# EAGLE design SpectrumCtrl (EAGLE 7.2.0)
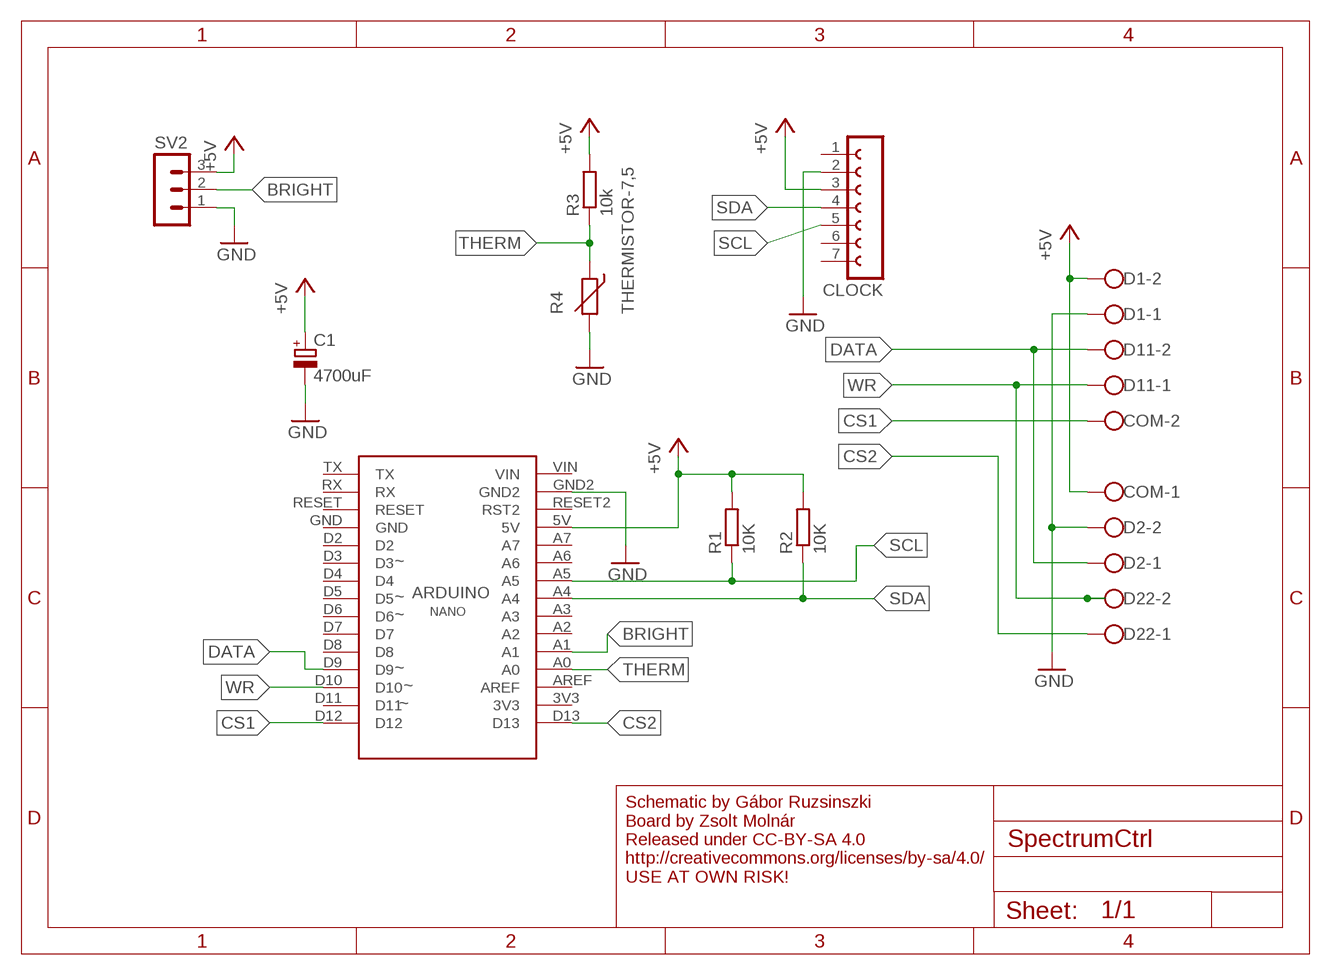
[diagram p0: schematic, sheet 1]

## Parts
C1  4700uF  CPOL-EUE7.5-16  [E7,5-16]
CLOCK  FE07-1  [FE07]
COM  W237-102  [W237-102]
D1  W237-102  [W237-102]
D2  W237-102  [W237-102]
D11  W237-102  [W237-102]
D22  W237-102  [W237-102]
R1  10K  R-EU_0309/12  [0309/12]
R2  10K  R-EU_0309/12  [0309/12]
R3  10k  R-EU_0309/12  [0309/12]
R4  THERMISTOR-7,5  [R-7,5]
SV2  MA03-1  [MA03-1]
U$1  NANO  [NANO]

## Nets
+5V: C1.+ CLOCK.3 COM.1 D1.2 R1.2 R2.2 R3.2 SV2.3 U$1.5V
BRIGHT: SV2.2 U$1.A1
CS1: COM.2 U$1.D12
CS2: D22.1 U$1.D13
DATA: D2.1 D11.2 U$1.D9
GND: C1.- CLOCK.2 D1.1 D2.2 R4.2 SV2.1 U$1.GND2
SCL: CLOCK.5 R1.1 U$1.A5
SDA: CLOCK.4 R2.1 U$1.A4
THERM: R3.1 R4.1 U$1.A0
WR: D11.1 D22.2 U$1.D10
Unconnected: CLOCK.1 CLOCK.6 CLOCK.7 U$1.3V3 U$1.A2 U$1.A3 U$1.A6 U$1.A7 U$1.AREF U$1.D2 U$1.D3 U$1.D4 U$1.D5 U$1.D6 U$1.D7 U$1.D8 U$1.D11 U$1.GND U$1.RESET U$1.RESET2(RST2) U$1.RX U$1.TX U$1.VIN

## Notes on the sheet
- Schematic by Gábor Ruzsinszki
  Board by Zsolt Molnár
  Released under CC-BY-SA 4.0
  http://creativecommons.org/licenses/by-sa/4.0/
  USE AT OWN RISK!

## Library data of the parts
C1 = rcl:CPOL-EU: POLARIZED CAPACITOR, European symbol
CLOCK = con-lsta:FE07-1: FEMALE HEADER; OC_FARNELL: unknown; OC_NEWARK: unknown
COM D1 D2 D11 D22 = con-wago-500:W237-102: WAGO SCREW CLAMP; MPN: 237-102; OC_FARNELL: unknown; OC_NEWARK: 70K9898
R1-R3 = rcl:R-EU_: RESISTOR, European symbol
R4 = varistor:THERMISTOR: THERMISTOR
SV2 = con-lstb:MA03-1: PIN HEADER; OC_FARNELL: unknown; OC_NEWARK: unknown
U$1 = Webmaster442:NANO: Arduino Nano

## Board
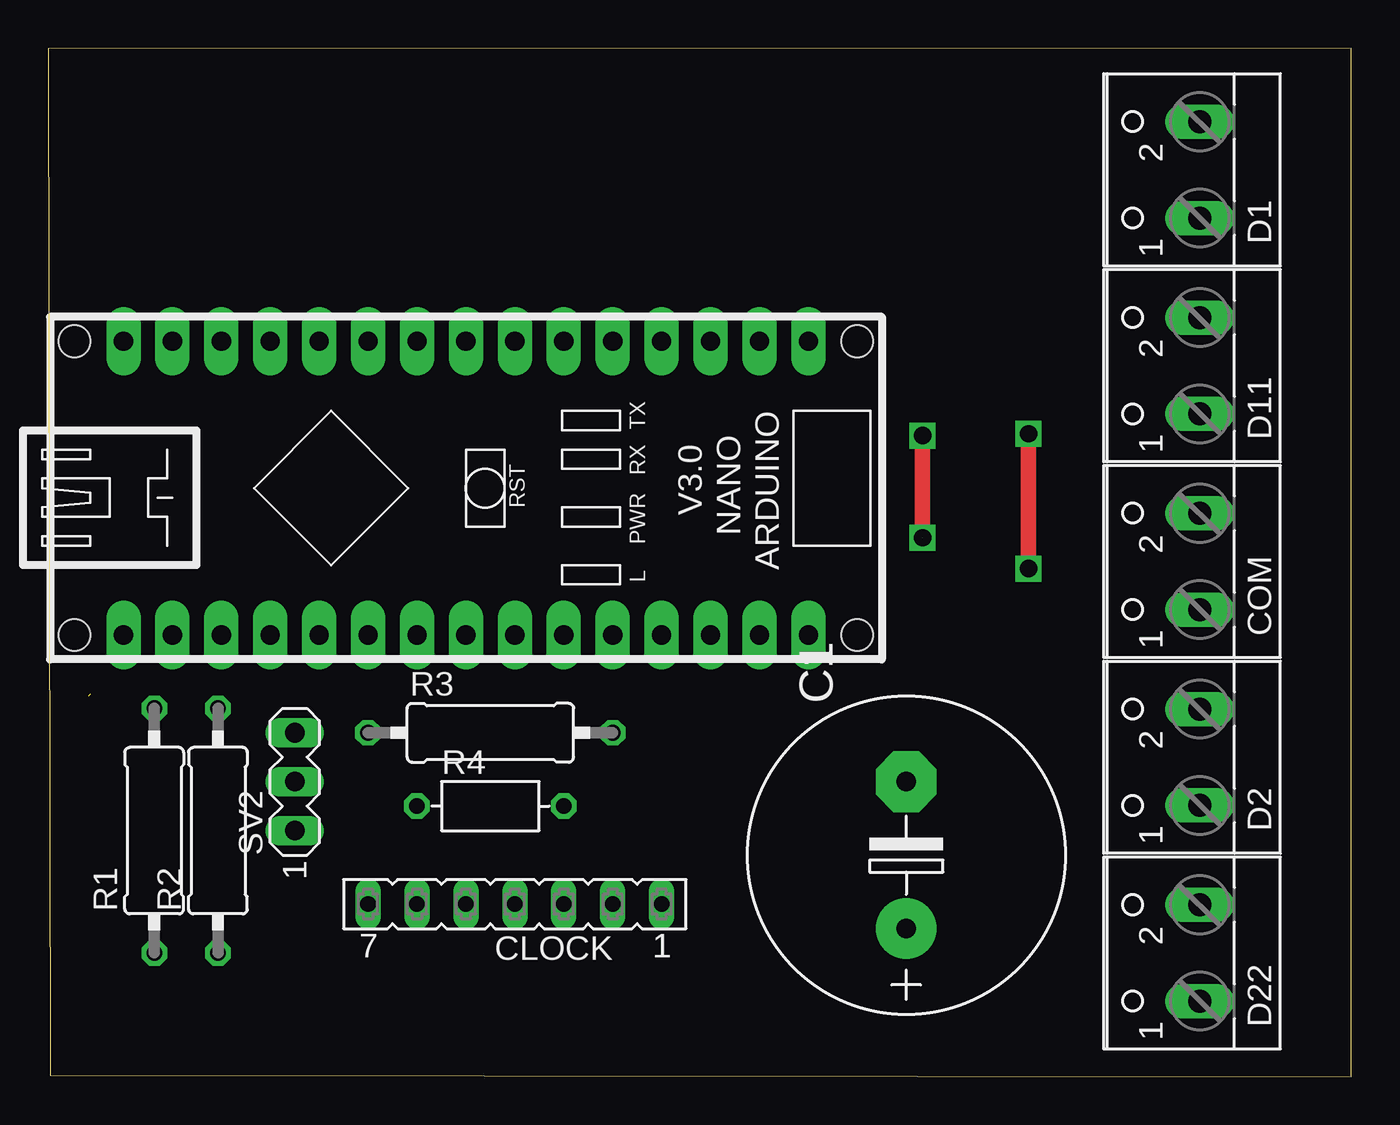
[diagram p1: board, top side]
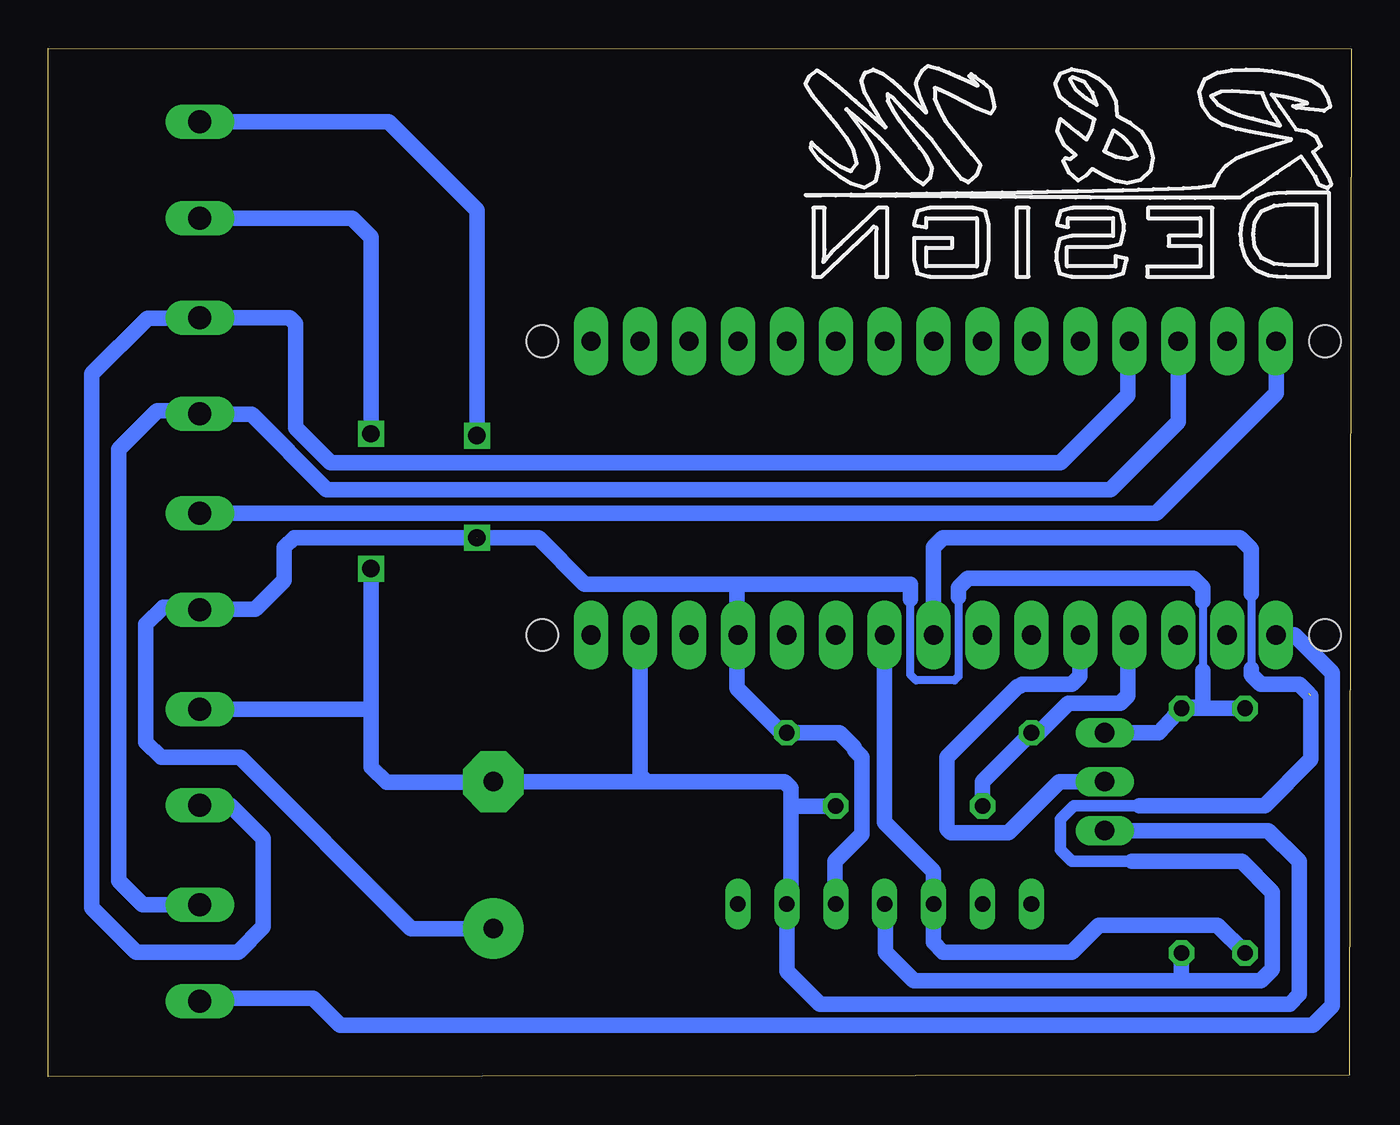
[diagram p2: board, bottom side, seen from below]

Size 67.66 x 53.38 mm. Coordinates in mm from the lower left corner, seen from the top.
Outline: 0.1,0.07 67.66,0 67.66,53.38 0,53.35 0.1,0.07
Copper layers (1*16): Top 0.035mm / dielectric 1.5mm / Bottom 0.035mm
Design rules "default": minimum track width 10mil, minimum drill 24mil, track to track 8mil, track to pad 8mil, pad to pad 8mil, via to via 8mil, smd to smd 8mil, copper to edge 40mil, drill to drill 8mil, minimum pad ring 10mil, minimum via ring 8mil, stop-mask expansion 4mil, vias tented up to drill 0mil, thermal gap 10mil

### Footprints (pad centres in the part's own frame; a part is rotated, then mirrored left to right if it is on the bottom)
E7,5-16 = drill 1.016 pad 3.15: + -3.81,0 | drill 1.016 pad 3.15 octagon: - 3.81,0
FE07 = drill 0.813 long: 1 -7.62,0; 2 -5.08,0; 3 -2.54,0; 4 0,0; 5 2.54,0; 6 5.08,0; 7 7.62,0
W237-102 = drill 1.194 long: 1 -2.5,-1.27; 2 2.5,-1.27
0309/12 = drill 0.813 octagon: 1 -6.35,0; 2 6.35,0
R-7,5 = drill 0.813 octagon: 1 -3.81,0; 2 3.81,0
MA03-1 = drill 1.016 long: 1 -2.54,0; 2 0,0; 3 2.54,0
NANO = drill 1 pad 1.778 long: 3V3 7.62,-15.24; 5V 7.62,10.16; A0 7.62,-10.16; A1 7.62,-7.62; A2 7.62,-5.08; A3 7.62,-2.54; A4 7.62,0; A5 7.62,2.54; A6 7.62,5.08; A7 7.62,7.62; AREF 7.62,-12.7; D2 -7.62,7.62; D3 -7.62,5.08; D4 -7.62,2.54; D5 -7.62,0; D6 -7.62,-2.54; D7 -7.62,-5.08; D8 -7.62,-7.62; D9 -7.62,-10.16; D10 -7.62,-12.7; D11 -7.62,-15.24; D12 -7.62,-17.78; D13 7.62,-17.78; GND -7.62,10.16; GND2 7.62,15.24; RESET -7.62,12.7; RESET2 7.62,12.7; RX -7.62,15.24; TX -7.62,17.78; VIN 7.62,17.78 | hole 1.651: -7.62,-20.32; 7.62,-20.32; -7.62,20.32; 7.62,20.32

### Placement (x,y rotation side)
C1  44.55,11.5 90 top
CLOCK  24.23,8.96 180 top
COM  58.52,26.74 90 top
D1  58.52,47.06 90 top
D2  58.52,16.58 90 top
D11  58.52,36.9 90 top
D22  58.52,6.42 90 top
R1  5.51,12.77 90 top
R2  8.82,12.77 90 top
R3  22.96,17.85 0 top
R4  22.96,14.04 0 top
SV2  12.8,15.31 90 top
U$1  21.69,30.55 270 top

### Tracks (layer width: path | path; a pad name or v marks a point on that pad's centre or on a via)
+5V  (via drill 0.9)  (1 unrouted)
  Top 0.813: v45.4,33.27 45.4,27.97
  Bottom 0.406: 7.7,24.67 7.7,21.07 | 20.4,24.87 20.4,20.77 20.6,20.57 22.6,20.57 22.9,20.87 22.9,24.77
  Bottom 0.813: R1.2 8.3,19.12 | 8.3,19.12 R2.2 9.99,17.85 SV2.3 | 31.9,22.88 31.9,20.17 29.58,17.85 R3.2 26.58,17.85 25.8,17.07 25.8,16.97 25.4,16.57 25.4,12.57 26.8,11.17 26.8,8.99 CLOCK.3 | 31.9,22.88 U$1.5V | C1.+ 48.82,7.69 57.7,16.57 61.8,16.57 62.6,17.37 62.6,23.47 61.7,24.37 59.92,24.37 COM.1 59.76,24.27 56.9,24.27 55.4,25.77 55.4,27.47 54.9,27.97 45.4,27.97 42.2,27.97 39.8,25.57 32,25.57 | 31.9,22.88 31.9,25.47 32,25.57 | 7.7,21.07 7.7,19.17 8.25,19.17 8.3,19.12 | 7.7,24.67 7.7,25.37 8.2,25.87 19.9,25.87 20.4,25.37 20.4,24.87 | 22.9,24.77 22.9,25.57 32,25.57 | D1.2 49.99,49.56 45.4,44.97 v45.4,33.27
BRIGHT
  Bottom 0.813: SV2.2 15.16,15.31 17.8,12.67 20.8,12.67 21,12.87 21,16.57 17.3,20.27 17.2,20.27 17.1,20.37 14.5,20.37 14.1,20.77 14.1,22.9 U$1.A1
CS1
  Bottom 0.813: COM.2 10.13,29.24 3.9,35.47 U$1.D12
CS2
  Bottom 0.813: U$1.D13 2.96,22.93 1,20.97 1,3.67 2,2.67 52.5,2.67 53.9,4.07 59.64,4.07 D22.1 59.54,3.67
DATA
  Bottom 0.813: D2.1 58.21,14.08 56.5,12.37 56.5,7.77 57.8,6.47 63.1,6.47 65.4,8.77 65.4,36.47 62.5,39.37 59.82,39.37 D11.2 55.13,39.4 54.8,39.07 54.8,33.67 53,31.87 15.1,31.87 11.6,35.37 11.6,38.1 U$1.D9
GND  (via drill 0.9)
  Top 0.813: v50.9,33.37 v50.9,26.37
  Bottom 0.813: U$1.GND2 36.93,15.64 36.6,15.31 | R4.2 29.03,14.04 | 29.03,14.04 29.1,13.97 29.1,9.17 CLOCK.2 29.3,5.47 27.6,3.77 3.2,3.77 2.7,4.27 2.7,11.17 4.3,12.77 SV2.1 | D1.1 51.89,44.56 50.9,43.57 v50.9,33.37 | v50.9,26.37 50.9,19.17 | 50.9,19.17 50.9,16.07 50.1,15.27 44.59,15.27 C1.- 36.6,15.31 | D2.2 50.99,19.08 50.9,19.17 | 36.6,15.31 29.44,15.31 29.1,14.97 29.1,14.11 29.03,14.04
N$1  (via drill 0.9)
  other vias: 45.4,27.97
SCL
  Bottom 0.813: R1.1 6.96,7.87 13.1,7.87 14.5,6.47 21.2,6.47 21.7,6.97 CLOCK.5 21.7,10.67 24.23,13.2 U$1.A5
SDA  (1 unrouted)
  Bottom 0.406: 5.2,25.07 5.2,21.17
  Bottom 0.61: 11,14.07 14.4,14.07 15.1,13.37 15.1,11.77 14.5,11.17 11.4,11.17
  Bottom 0.813: CLOCK.4 24.2,8.93 24.2,6.47 22.7,4.97 8.9,4.97 | 5.2,21.17 5.2,20.87 4.7,20.37 2.7,20.37 2.2,19.87 | 2.1,19.77 2.1,16.47 4.5,14.07 11,14.07 | 11.4,11.17 5.7,11.17 4.1,9.57 4.1,5.57 4.7,4.97 8.9,4.97 | U$1.A4 21.69,27.48 21.2,27.97 5.8,27.97 5.2,27.37 5.2,25.07 | R2.1 8.82,5.05 8.9,4.97
THERM
  Bottom 0.813: U$1.A0 11.6,22.86 11.6,19.77 12,19.37 14.7,19.37 16.22,17.85 R3.1 19.15,15.31 R4.1
WR
  Bottom 0.813: D22.2 62.75,8.92 64,10.17 64,32.57 62,34.57 59.96,34.57 D11.1 59.76,34.37 57.1,34.37 53.2,30.47 12.5,30.47 8.99,33.98 U$1.D10